# Altium project Lab_1.PrjPcb
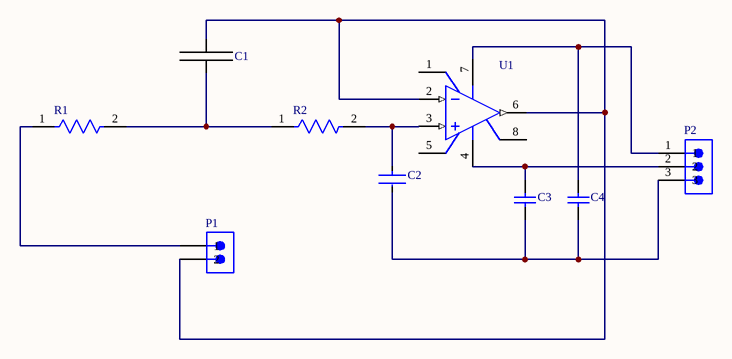
[diagram p0: Sheet2.SchDoc]
1 sheet, 9 parts. Net scope: global (net labels, ports and power ports of the same name join across sheets).
Board file: PCB1.PcbDoc

## Sheet Sheet2.SchDoc
size A4; SheetNumber: 1; SheetTotal: 1

### Parts
C1  Cap_0805  [C_0805]  (value not drawn)
C2  C0402C152K5RACTU  [FP-C0402-BB-MFG]  (value not drawn)
C3  1206GC102KAT1A  [AVX-1206-2_L]  (value not drawn)
C4  1206GC102KAT1A  [AVX-1206-2_L]  (value not drawn)
P1  691701510002B  [691701510002B]  (value not drawn)
P2  620303124022  [620303124022]  (value not drawn)
R1  RG1005P-393-B-T5  [FP-RG1005-IPC_B]  (value not drawn)
R2  RG1005P-393-B-T5  [FP-RG1005-IPC_B]  (value not drawn)
U1  LM741H  [LMC0008A]  (value not drawn)

### Nets
NetC1_1: C1.1 R1.2 R2.1
NetC1_2: C1.2 P1.2 U1.2(IN-) U1.6(OUT)
NetC2_1: C2.1 R2.2 U1.3(IN+)
NetC2_2: C2.2 C3.1 C4.1 P2.3
NetC3_2: C3.2 P2.2 U1.4(V-)
NetC4_2: C4.2 P2.1 U1.7(V+)
NetP1_1: P1.1 R1.1

Not connected (* = marked no-connect by the designer): U1 1(OFS_NULL) 5(OFS_NULL) 8(NC)

### Library data of the parts
C2 = CMP-2008-03108-2: CAP CER 1500PF 50V X7R 0402; Manufacturer: Kemet; Value: 1,500 pF; Material: Ceramic; Tolerance: 0.1; Temperature Coefficient: 15%; Description: C0402 1,500 pF X7R 10.00% 50 V; Automotive: No; Octopart: https://octopart.com/c0402c152k5ractu-kemet-125298; Device Class L3: Ceramic Capacitors; Device Class L2: Capacitors; Mouser Description: Multilayer Ceramic Capacitors MLCC - SMD/SMT 50volts 1500pF X7R 10%; Temperature Range High: +125°C; ComponentLink2URL: https://content.kemet.com/datasheets/KEM_C1002_X7R_SMD.pdf; ComponentLink2Description: Datasheet; RoHS: TRUE; Temperature: -55°C to +125°C; Height: 0.55mm; Device Class L1: Passive Components; Voltage Rating: 50 V; Lead Free: Yes; Temperature Characteristic: X7R; Temperature Range Low: -55°C; Capacitance: 1,500 pF; Package: C0402-BB; Category: Cap; Manufacturer Part Number: C0402C152K5RACTU; Digikey Description: CAP CER 1500PF 50V X7R 0402; Ipc Land Pattern Name: CAPC10050X50
C3 C4 = CMP-2000-05468-1: Chip Capacitor, 1 nF, +/- 10%, -55 to 125 degC, 1206 (3216 Metric), RoHS, Tape and Reel; Manufacturer: AVX; Capacitance: 0.001uF; Dielectric: X7R; Voltage Rating DC: 2000V; Package Reference: 1206; Datasheet Version: 11/2010; Mounting Technology: SurfaceMount; Manufacturer URL: http://www.avx.com/; Tolerance: 10%; Tolerance (%): ±10%; PartNumber: 1206GC102KAT1A; Datasheet URL: https://datasheet.ciiva.com/11787/0900766b80ed4c37-11787781.pdf; Package Description: 2-Pin SMD, Body 3.4 x 1.8 mm; Case Size/Dimension: 1206; Rated Voltage: 2000V
P1 = CMP-1502-02329-2: NexarPartId: 22866752; Connector Type: Terminal Block; Current Rating: 10A; Voltage Rating: 300V; Number of Contacts: 2; Gender: Male; Pitch: 5.08mm; RoHS: Compliant; Contact Gender: Male; Lead Pitch: 5.08mm; Termination: PCB; Color: Black; Housing Material: Polymer; Length: 12.96mm; Mount: Through Hole; Contact Plating: Tin; Max Operating Temperature: 105°C; REACH SVHC: Unknown; Number of Pins: 2; Min Operating Temperature: -40°C; Contact Material: Brass
P2 = CMP-1502-00661-2: NexarPartId: 18818243; Connector Type: Male Pin; Insulation: Insulated; Pitch: 2mm; Number of Contacts: 3; Contact Resistance: 20mΩ; Insulation Resistance: 1GΩ; Operating Supply Voltage: 100V; Gender: Male; Current Rating: 2A; Voltage Rating: 125V; Orientation: Vertical; RoHS: Compliant; Flammability Rating: UL94 V-0; REACH SVHC: Unknown; Max Operating Temperature: 85°C; Width: 9.9mm; Contact Plating: Tin; Min Operating Temperature: -40°C; Contact Gender: Male; Housing Material: Nylon; Lead Pitch: 2mm; Number of Pins: 3; Number of Positions: 3; Color: Beige, White; Length: 7mm; Termination: SMD/SMT; Lead Free: Lead Free; Height: 6.6mm; Number of Rows: 1; Packaging: Tape and Reel; Contact Material: Copper; Mount: Surface Mount; Contact Mating Length: 3.5052mm
R1 R2 = CMP-2002-01450-2: Automotive Metal Thin Film Chip Resistor, 0402, 39kΩ, 0.1%, 25ppm/°C, 0.0625W, 75V; Voltage Rating (DC): 25V; Max Power Dissipation: 63mW; Resistance: 39kR; Number of Terminations: 2; Case/Package: 0402; Temperature Coefficient: 25ppm/°C; Number of Pins: 2; Packaging: Tape and Reel; Weight: 2.3E-05oz; Length: 1mm; Size Code: 0402; Resistance Tolerance: 0.1%; Case Code (Imperial): 0402; Min Operating Temperature: -55°C; Series: RG; RoHS Compliant: Yes; Resistor Type: Thin Film; Height: 0.35mm; Features: Automotive AEC-Q200; Lead Free: Lead Free; Width: 0.5mm; Tolerance: 0.1%; Termination: SMD/SMT; Max Operating Temperature: 155°C; Power Rating: 63mW; Case Code (Metric): 1005; Voltage Rating: 75V
U1 = CMP-0055-00031-3: Operational Amplifier, 8-pin TO-99; Manufacturer: Texas Instruments; PackageTopMarking: NSZXYTTE# LM741H; CompType: Amplifiers; PowerWise: N; ComponentLink1Description: Datasheet URL; PinCount: 8; ComponentLink1URL: http://www.ti.com/general/docs/lit/getliterature.tsp?genericPartNumber=LM741&fileType=pdf; Package Reference: LMC0008A; RoHS: N; PackageDescription: Metal Can, TO-99, 8 Lead, .200 Dia., P.C.; Code_JEDEC: TO-99